# EAGLE design EEZ AUX PS r4B39 (EAGLE 6.1)
Assembly variants: Farnell, TME
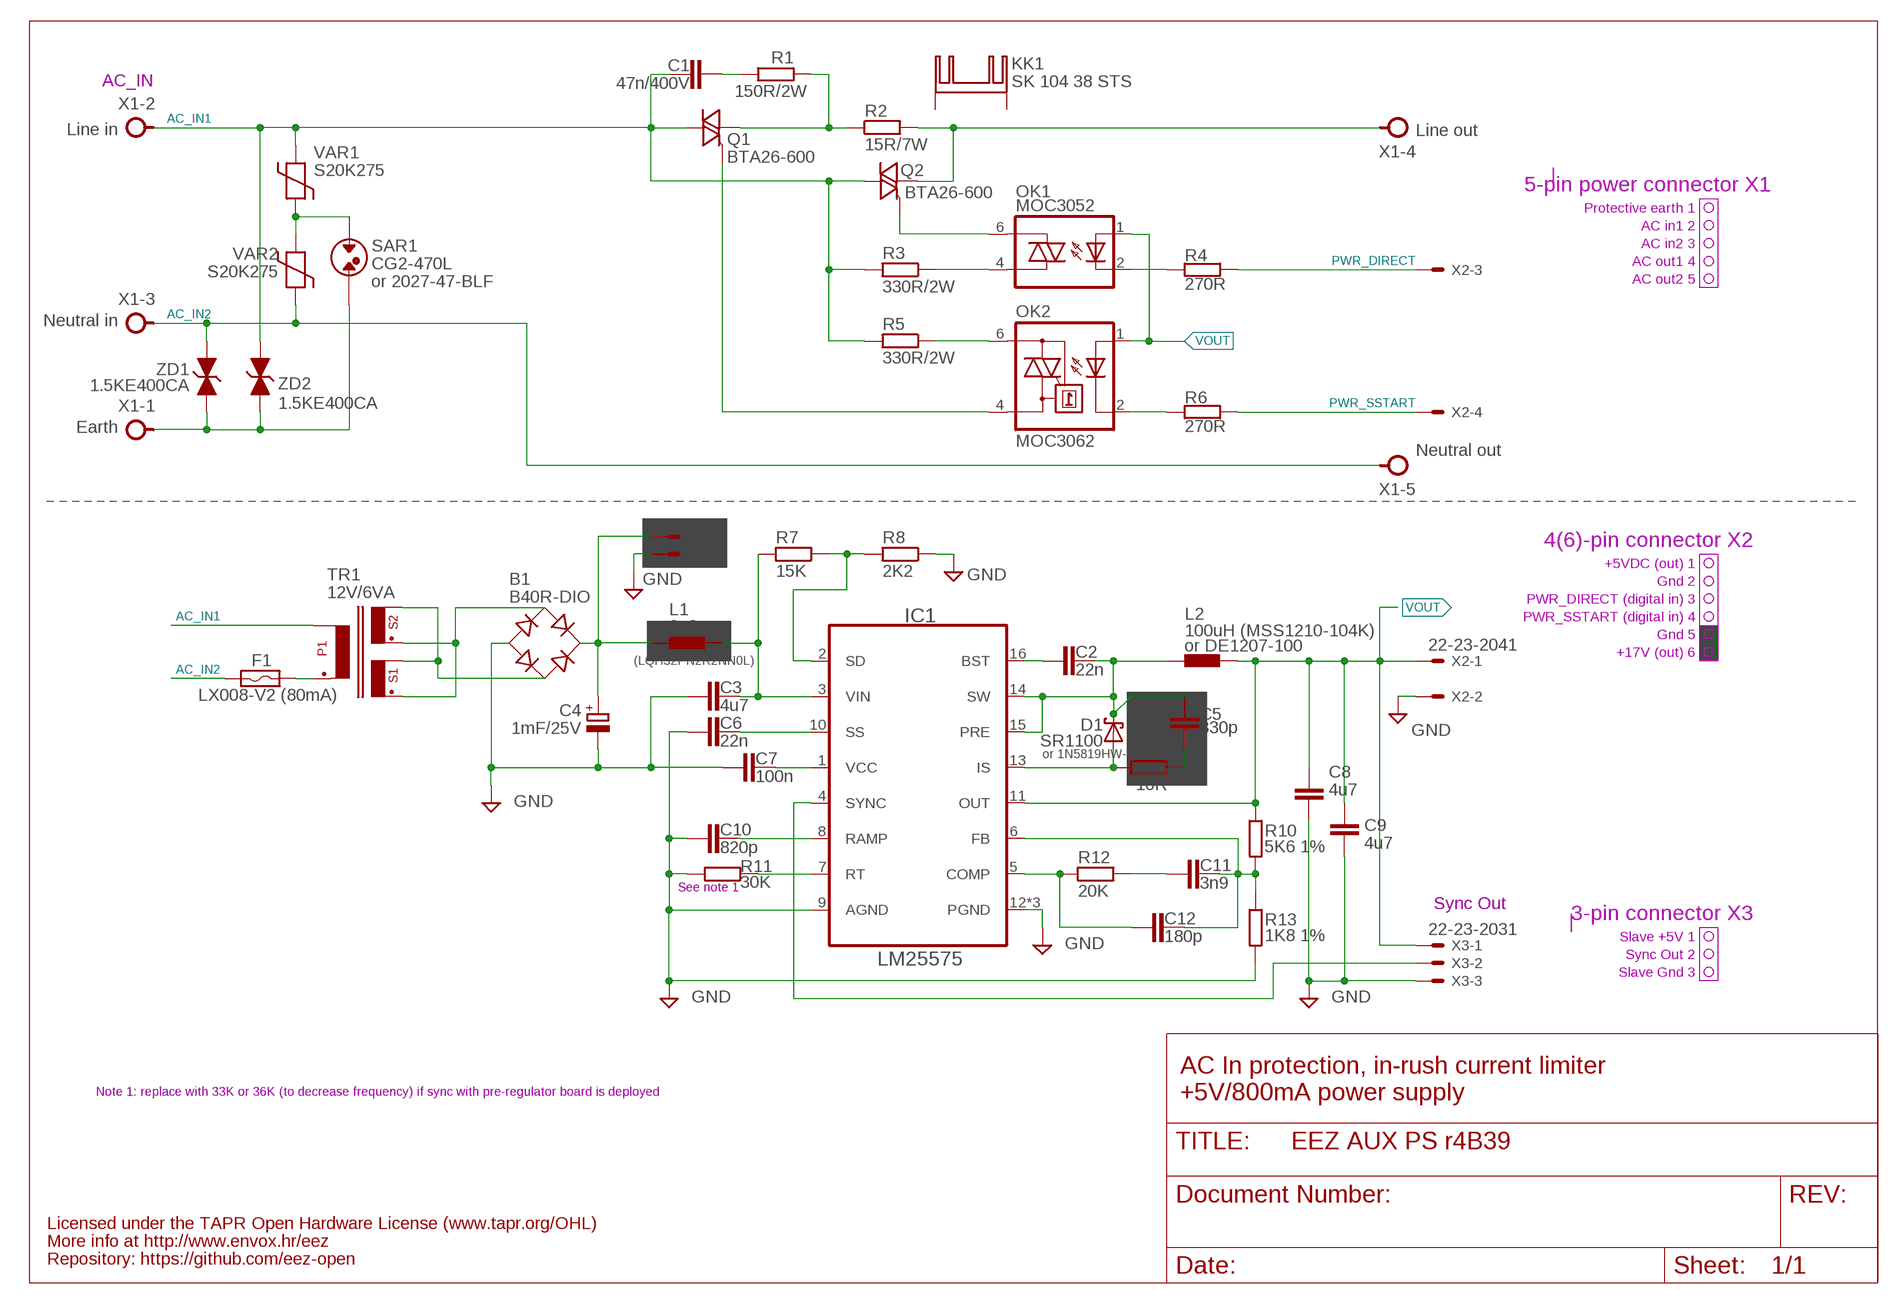
[diagram p0: schematic, sheet 1]

## Parts
B1  B40R-DIO  RECTIFIER-RB1A  [RB1A]
C1  47n/400V  C-EU075-052X106  [C075-052X106]
C2  22n  C-EUC0805  [C0805]
C3  4u7  C-EUC1210  [C1210]
C4  1mF/25V  ECAP5G_10.5MM  [ECAP5/10.5]
C5  330p  C-EUC0805  [C0805]
C6  22n  C-EUC0805  [C0805]
C7  100n  C-EUC0805  [C0805]
C8  4u7  C-EUC1210  [C1210]
C9  4u7  C-EUC1210  [C1210]
C10  820p  C-EUC0805  [C0805]
C11  3n9  C-EUC0805  [C0805]
C12  180p  C-EUC0805  [C0805]
D1  SR1100  SCHOTTKYDO34+SOD123  [DO34+SOD123]
F1  LX008-V2 (80mA)  FUSE_RESETTABLER7  [POLYSWITCH-R7]
IC1  LM25575  LM(2)5575  [SOP65P640X110-17N_HOLE]
KK1  SK 104 38 STS  SK409  [SK409]
L1  2u2  L1210  [L1210]
L2  100uH (MSS1210-104K)  COILCRAFT_MSS1278  [MSS1278]
OK1  MOC3052  MOC305X  [DIL6-SMD]
OK2  MOC3062  MOC3033S  [DIL6-SMD]
Q1  BTA26-600  BTA26-V  [TOP3S-1]
Q2  BTA26-600  BTA26-V  [TOP3S-1]
R1  150R/2W  R-EU_R2512  [R2512]
R2  15R/7W  R_EU7W  [R_0913]
R3  330R/2W  R-EU_R2512  [R2512]
R4  270R  R-EU_R0805  [R0805]
R5  330R/2W  R-EU_R2512  [R2512]
R6  270R  R-EU_R0805  [R0805]
R7  15K  R-EU_R0805  [R0805]
R8  2K2  R-EU_R0805  [R0805]
R9  10R  R-EU_R1206  [R1206]
R10  5K6 1%  R-EU_R0805  [R0805]
R11  30K  R-EU_R0805  [R0805]
R12  20K  R-EU_R0805  [R0805]
R13  1K8 1%  R-EU_R0805  [R0805]
SAR1  CG2-470L  SAR  [SAR]
TR1  12V/6VA  PCB_TRAFO6VACOMBO  [PCB_TRAFO6VA_DUAL]
VAR1  S20K275  VARISTOR  [VARISTOR]
VAR2  S20K275  VARISTOR  [VARISTOR]
X1  AC_IN  TBLOCK5.0_5A  [TBLOCK5.0_5]
X2  22-23-2041  22-23-2061  [22-23-2061]
X3  22-23-2031  [22-23-2031]
ZD1  1.5KE400CA  1.5KE-BIDIR  [DO201-BIDIR]
ZD2  1.5KE400CA  1.5KE-BIDIR  [DO201-BIDIR]

## Nets
AC_EARTH: SAR1.P$2 X1.1 ZD1.C ZD2.C
AC_IN1: C1.2 Q1.A2 Q2.A2 R3.2 R5.2 TR1.NC1(P1) TR1.P1 TR1.P1.1(P1) TR1.P1.2(P1) VAR1.P$2 X1.2 ZD2.A
AC_IN2: F1.P$1 VAR2.P$1 X1.3 X1.5 ZD1.A
DC_PREG1: C3.1 IC1.3(VIN) L1.2 R7.2
GND [gnd]: B1.- C3.2 C4.- C6.2 C7.1 C8.2 C9.2 C10.1 IC1.9(AGND) IC1.12(PGND) IC1.TP2(PGND) IC1.TP(PGND) R8.1 R11.2 R13.2 X2.2 X2.5 X3.3
IS: D1.A D1.A.1(A) IC1.13(IS) R9.1
N$1: C5.2 R9.2
N$2: OK1.6(A2) Q2.G
N$3: OK1.4(A1) R3.1
N$4: OK2.4(A1) Q1.G
N$5: OK1.2(C) R4.1
N$6: OK2.2(C) R6.1
N$7: OK2.6(A2) R5.1
N$8: Q2.A1 R2.2 X1.4
N$13: IC1.4(SYNC) X3.2
N$15: C1.1 R1.1
N$16: Q1.A1 R1.2 R2.1
N$40: B1.AC2 TR1.S1.2 TR1.S1.2A(S1.2) TR1.S1.2NC(S1.2) TR1.S2.2
N$77: C11.2 R12.2
N$114: SAR1.P$1 VAR1.P$1 VAR2.P$2
N$128: C11.1 C12.1 IC1.6(FB) R10.2 R13.1
N$131: C2.2 IC1.16(BST)
N$135: C12.2 IC1.5(COMP) R12.1
N$141: B1.AC1 TR1.S1.1 TR1.S2.1 TR1.S2.1A(S2.1)
N$162: F1.P$2 TR1.P2 TR1.P2.1(P2) TR1.P2.2(P2)
N$165: IC1.7(RT) R11.1
N$166: C7.2 IC1.1(VCC)
N$167: C10.2 IC1.8(RAMP)
N$168: C6.1 IC1.10(SS)
N$180: IC1.2(SD) R7.1 R8.2
PWR_DIRECT: R4.2 X2.3
PWR_SSTART: R6.2 X2.4
SW: C2.1 C5.1 D1.C D1.C.1(C) IC1.14(SW) IC1.15(PRE) L2.1
VIN: B1.+ C4.+ L1.1 X2.6
VOUT: C8.1 C9.1 IC1.11(OUT) L2.2 OK1.1(A) OK2.1(A) R10.1 X2.1 X3.1
Unconnected: KK1.K1(K) KK1.K2(K)

## Notes on the sheet
- Line in
- Line out
- 5-pin power connector X1
- Protective earth 1
- AC in1 2
- AC in2 3
- AC out1 4
- AC out2 5
- or 2027-47-BLF
- Neutral in
- Earth
- Neutral out
- 4(6)-pin connector X2
- +5VDC (out) 1
- Gnd 2
- PWR_DIRECT (digital in) 3
- PWR_SSTART (digital in) 4
- Gnd 5
- +17V (out) 6
- or DE1207-100
- (LQH32PN2R2NN0L)
- or 1N5819HW-7-F
- See note 1
- Sync Out | 3-pin connector X3
- Slave +5V 1
- Sync Out 2
- Slave Gnd 3
- AC In protection, in-rush current limiter
- Note 1: replace with 33K or 36K (to decrease frequency) if sync with pre-regulator board is deployed
- +5V/800mA power supply
- Licensed under the TAPR Open Hardware License (www.tapr.org/OHL)
- More info at http://www.envox.hr/eez
- Repository: https://github.com/eez-open

## Library data of the parts
B1 = rectifier:RECTIFIER-: Rectifier
C1-C3 C5-C12 = rcl:C-EU: CAPACITOR, European symbol
C4 = EEZ_Lib1:ECAP
D1 = EEZ_Lib1:SCHOTTKY
F1 = EEZ_Lib1:FUSE_RESETTABLE
IC1 = EEZ_Lib1:LM(2)5575: Simple Switcher® 42V, 1.5A Step-Down Switching Regulator
KK1 = EEZ_Lib1:SK409
L1 = EEZ_Lib1:L1210
L2 = EEZ_Lib1:COILCRAFT_MSS1278: Coilcraft SMT Power Inductors – MSS1278
OK1 = EEZ_Lib1:MOC305X: 6-pin DIP Random-phase Optoisolators Triac Drivers (600V Peak)
OK2 = optocoupler:MOC30*: 6-Pin DIP Zero-Cross Optoisolators Triac Driver Output (250/400 Volt Peak) Source: http://www.fairchildsemi.com/ds/MO/MOC3043-M.pdf; MF: FAIRCHILD SEMICONDUCTOR; MPN: MOC3033S-M; OC_FARNELL: unknown; OC_NEWARK: 05C2878
Q1 Q2 = triac:BTA26: 25A TRIAC Source: http://www.st.com/stonline/products/literature/ds/7470.pdf
R1 R3-R13 = rcl:R-EU_: RESISTOR, European symbol
R2 = EEZ_Lib1:R_EU: RESISTOR - European symbol
SAR1 = EEZ_Lib1:SAR: EPCOS surge arrester EF470X Farnell: 1886596
TR1 = EEZ_Lib1:PCB_TRAFO6VA: TEZ 6VA transformer for PCB
VAR1 VAR2 = MyLib:VARISTOR: EPCOS - B72220S0251K101 - VARISTOR, 140J, 250VAC Farnell: 1004357
X1 = EEZ_Lib1:TBLOCK5.0_5A
X2 = con-molex:22-23-2061: .100" (2.54mm) Center Header - 6 Pin; MF: MOLEX; MPN: 22-23-2061; OC_FARNELL: 1462922; OC_NEWARK: 27C1933
X3 = con-molex:22-23-2031: .100" (2.54mm) Center Header - 3 Pin; MF: MOLEX; MPN: 22-23-2031; OC_FARNELL: 1462950; OC_NEWARK: 30C0862
ZD1 ZD2 = EEZ_Lib1:1.5KE-BIDIR

## Net classes
0 default: width 0.254 mm, drill 0.61 mm
2 gnd: width 0.254 mm, drill 0.61 mm, clearance 0.254 mm

## Board
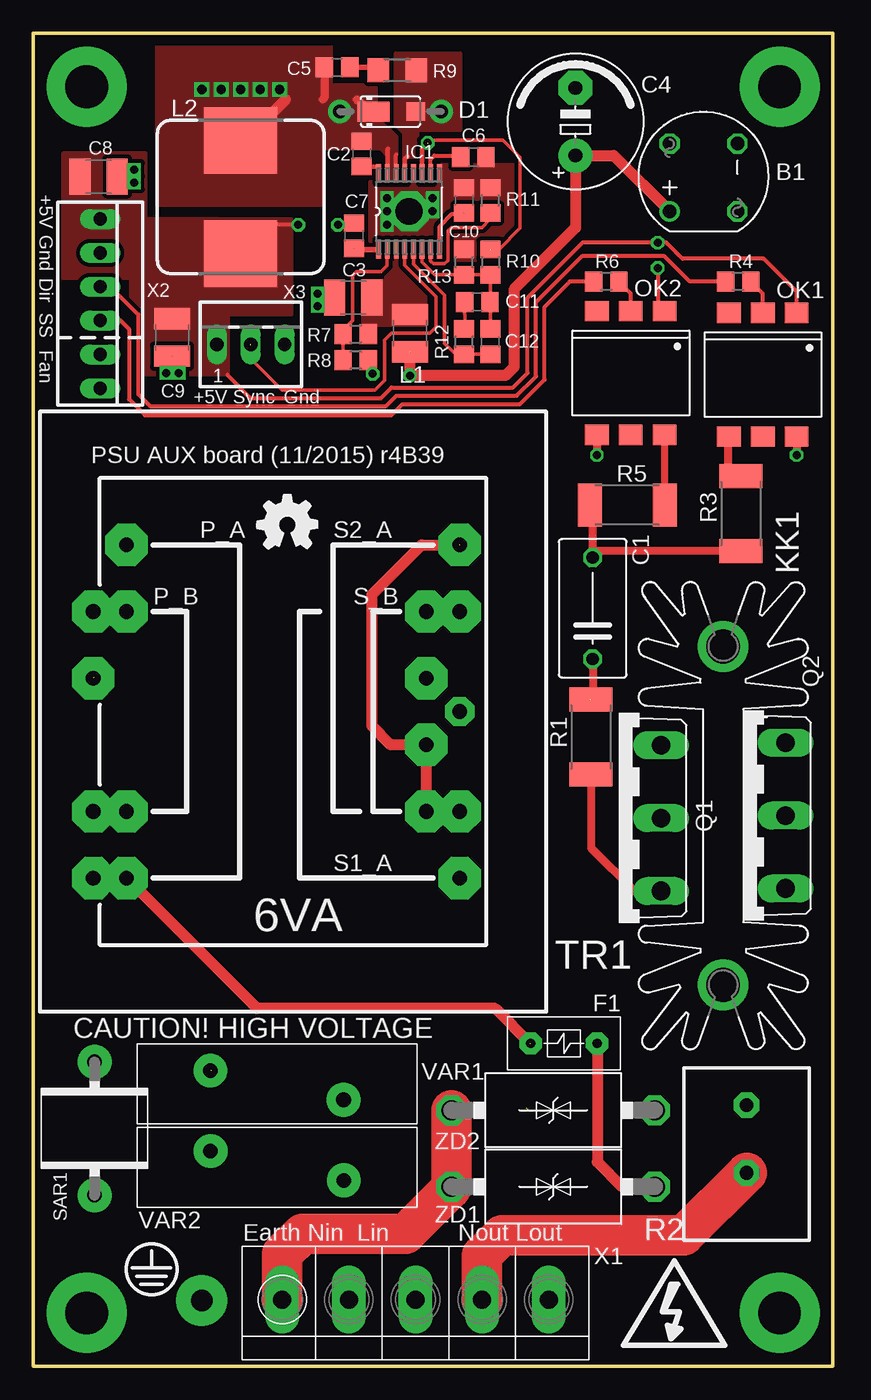
[diagram p1: board, top side]
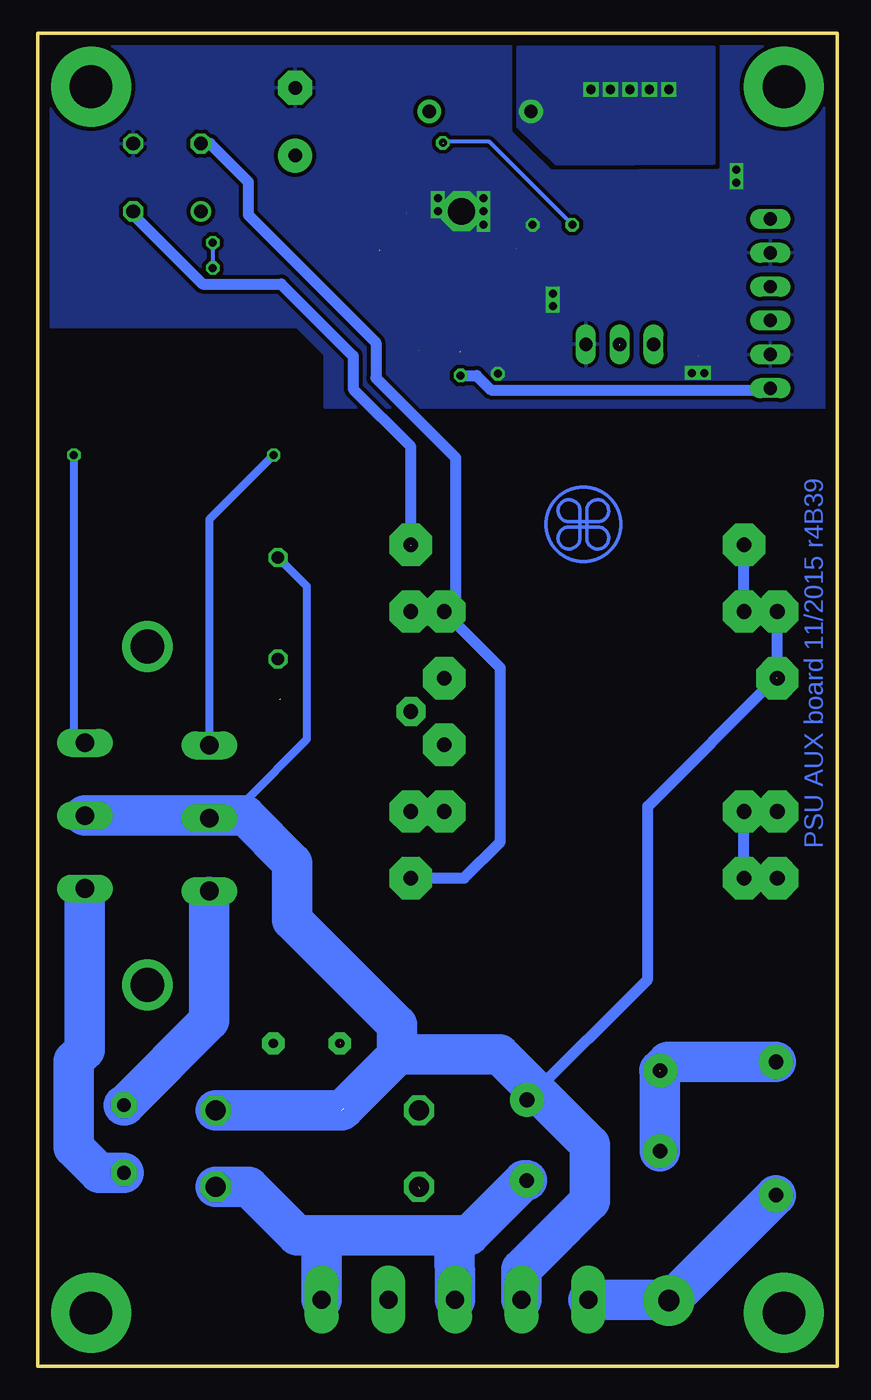
[diagram p2: board, bottom side, seen from below]

Size 60 x 100 mm. Coordinates in mm from the lower left corner, seen from the top.
Outline: 0,0 0,100 60,100 60,0 0,0
Copper layers (1+5*16): Top 0.035mm / dielectric 0.75mm / Route5 0.035mm / dielectric 0.75mm / Bottom 0.035mm
Design rules: minimum track width 10mil, minimum drill 0.5mm, track to track 8mil, track to pad 8mil, pad to pad 8mil, via to via 8mil, smd to smd 8mil, copper to edge 30mil, drill to drill 8mil, minimum pad ring 10mil, minimum via ring 8mil, stop-mask expansion 0mil, vias tented up to drill 25mil, thermal gap 10mil

### Footprints (pad centres in the part's own frame; a part is rotated, then mirrored left to right if it is on the bottom)
RB1A = drill 1.016: + -2.54,2.54 | drill 1.016 octagon: - 2.54,-2.54; AC1 2.54,2.54; AC2 -2.54,-2.54
C075-052X106 = drill 0.914 octagon: 1 -3.81,0; 2 3.81,0
C0805 = smd 1.3 x 1.5: 1 -0.95,0; 2 0.95,0
C1210 = smd 1.6 x 2.7: 1 -1.4,0; 2 1.4,0
ECAP5/10.5 = drill 1.016 pad 2.54: + -2.54,0 | drill 1.016 pad 2.54 octagon: - 2.54,0
DO34+SOD123 = drill 1 pad 1.778: A 3.81,0; C -3.81,0 | smd 1.4 x 1.4: A.1 1.9,0 | smd 2.4 x 1.5: C.1 -1.27,0
POLYSWITCH-R7 = drill 0.7 pad 1.676 octagon: P$1 -2.5,0; P$2 2.5,0
SOP65P640X110-17N_HOLE = smd 1.422 x 0.356: 1 -2.845,2.286; 2 -2.845,1.626; 3 -2.845,0.965; 4 -2.845,0.33; 5 -2.845,-0.33; 6 -2.845,-0.965; 7 -2.845,-1.626; 8 -2.845,-2.286; 9 2.845,-2.286; 10 2.845,-1.626; 11 2.845,-0.965; 12 2.845,-0.33; 13 2.845,0.33; 14 2.845,0.965; 15 2.845,1.626; 16 2.845,2.286 | smd 2.032 x 2.032: TP 0,0 | drill 2 octagon: TP2 0,0
SK409 = drill 2.54 pad 3.81: K1 -12.7,-1.512; K2 12.7,-1.512
L1210 = smd 1.6 x 2.7: 1 -1.4,0; 2 1.4,0
MSS1278 = smd 5.5 x 5: 1 0,4.25; 2 0,-4.25
DIL6-SMD = smd 1.78 x 1.52: 1 -2.54,-4.645; 2 0,-4.645; 3 2.54,-4.645; 4 2.54,4.645; 5 0,4.645; 6 -2.54,4.645
TOP3S-1 = drill 1.397 long: A1 -5.461,-3.175; A2 0,-3.175; G 5.461,-3.175
R2512 = smd 1.8 x 3.2: 1 -2.8,0; 2 2.8,0
R_0913 = drill 1.016 pad 1.93 octagon: 1 -3.556,0; 2 1.524,0
R0805 = smd 1.3 x 1.5: 1 -0.95,0; 2 0.95,0
R1206 = smd 1.6 x 1.803: 1 -1.422,0; 2 1.422,0
SAR = drill 1.1 pad 2.54: P$1 0,0; P$2 10,0
PCB_TRAFO6VA_DUAL = drill 1.1 pad 3.175 octagon: NC1 -15,2.5; NC2 -15,-12.5; NC4 10,2.5; P1 -12.5,12.5; P1.1 -12.5,7.5; P1.2 -15,7.5; P2 -12.5,-12.5; P2.1 -12.5,-7.5; P2.2 -15,-7.5; S1.1 12.5,-12.5; S1.2 12.5,-7.5; S1.2A 10,-2.5; S1.2NC 10,-7.5; S2.1 12.5,7.5; S2.1A 10,7.5; S2.2 12.5,12.5 | drill 1.1 pad 2.184 octagon: NC3 12.5,0
VARISTOR = drill 1.1 pad 2.54: P$1 0,0; P$2 10,-2.2
TBLOCK5.0_5 = drill 1.35 pad 2.54 long: 1 0,0; 2 0,-5; 3 0,-10; 4 0,-15; 5 0,-20
22-23-2061 = drill 1 long: 1 -6.35,0; 2 -3.81,0; 3 -1.27,0; 4 1.27,0; 5 3.81,0; 6 6.35,0
22-23-2031 = drill 1 long: 1 -2.54,0; 2 0,0; 3 2.54,0
DO201-BIDIR = drill 1.499 octagon: A 7.62,0; C -7.62,0

### Placement (x,y rotation side)
B1  50.29,89.18 90 top
C1  41.98,56.86 90 top
C2  24.64,90.96 270 top
C3  24.01,80.17 180 top
C4  40.68,93.37 90 top
C5  22.8,97.44 0 top
C6  33.02,90.71 0 top
C7  24.07,84.8 270 top
C8  4.89,89.25 0 top
C9  10.42,77.18 270 top
C10  32.32,87.47 270 top
C11  33.31,79.85 180 top
C12  34.29,76.86 270 top
D1  26.8,94.14 0 top
EEZ_SIGNATURE  SIGNATURESMALL  [SIGNATURE_5MM]  19.05,63.16 180 top
F1  39.82,24.22 180 top
IC1  28.2,86.64 90 top
KK1  53.28,41.3 270 top
L1  28.26,77.5 90 top
L2  15.56,87.72 0 top
OK1  54.74,74.39 180 top
OK2  44.83,74.52 180 top
Q1  43.94,41.11 90 top
Q2  53.28,41.3 90 top
R1  41.85,47.21 270 top
R2  53.53,16.03 270 top
R3  53.09,63.97 270 top
R4  52.9,81.37 180 top
R5  44.58,64.61 180 top
R6  42.99,81.37 180 top
R7  24.2,77.44 0 top
R8  24.2,75.47 180 top
R9  27.31,97.25 180 top
R10  34.29,82.83 270 top
R11  34.29,87.47 90 top
R12  32.32,76.86 90 top
R13  32.32,82.83 90 top
SAR1  4.6,22.83 270 top
TR1  19.5,49.12 0 top
VAR1  13.28,22.18 0 top
VAR2  23.3,13.93 180 top
X1  18.68,5 90 top
X2  5.02,79.72 270 top
X3  16.32,76.67 0 top
ZD1  39.02,13.46 0 top
ZD2  39.02,19.19 0 top

### Tracks (layer width: path | path; a pad name or v marks a point on that pad's centre or on a via)
AC_EARTH  (via drill 1.6 pad 3.81)  (1 unrouted)
  Top 3.048: ZD1.C ZD2.C | X1.1 18.68,8.42 20.2,9.94 27.94,9.94 31.31,13.3
  Bottom 3.048: X1.1 12.75,5 v12.64,4.92 12.51,4.92 SAR1.P$2
AC_IN1  (2 unrouted)
  Top 0.61: C1.2 41.98,61.18 | 41.98,61.18 41.98,64.41 R5.2 | R3.2 41.98,61.17 41.98,61.18
  Bottom 0.61: C1.2 39.82,58.51 39.82,47.02 44.45,42.38 44.45,41.3 | Q1.A2 44.83,41.11 44.64,41.3
  Bottom 0.813: TR1.NC1 TR1.P1.2 TR1.P1.1 TR1.P1 | 4.58,51.66 14.23,42 14.23,29.04 VAR1.P$2 22.51,20.76 25.15,23.4 25.34,23.4
  Bottom 3.048: X1.2 23.68,7.27 18.55,12.41 18.55,16.6 25.34,23.4 32.96,23.4 33.02,23.33 | Q2.A2 44.64,41.3 44.45,41.3 40.9,37.75 40.9,33.49 33.02,25.62 33.02,23.33 | 37.21,19.21 46.62,19.21 ZD2.A | 33.02,23.33 37.02,19.33
AC_IN2
  Top 0.813: 45.41,13.46 ZD1.A 44.17,13.46 42.32,15.32 F1.P$1
  Bottom 3.048: ZD1.A 44.17,13.46 40.52,9.81 38.67,9.81 | X1.5 38.68,9.8 38.67,9.81 | 28.7,9.81 27.62,9.81 23.5,13.93 VAR2.P$1 | 28.7,9.81 38.67,9.81 | X1.3 28.7,9.81
DC_PREG1
  pour Top (isolate 0.305, no thermals): 27.18,83.79 27.31,83.79 27.31,82.58 27.82,82.07 29.02,80.93 29.47,80.55 29.47,78.07 24.7,78.07 24.7,81.5 26.42,81.5 26.42,82.83 27.18,82.83
GND  (via drill 0.6)  (1 unrouted)
  Top 0.254: v21.34,80.48 22.29,80.48 C3.2 | v25.47,74.45 R8.1
  Top 0.305: C7.1 v22.86,85.63 | v9.97,74.52 9.91,75.28 C9.2 | v7.56,88.8 6.8,88.74 C8.2
  other vias: 10.92,74.52 7.56,89.75 26.55,87.65 26.55,86.64 26.55,85.64 21.34,79.53 29.97,87.65 29.97,86.64
  pour Bottom (isolate 0.305, rank 2): 0.32,99.6 59.69,99.6 59.69,78.01 40.52,78.01 38.42,75.91 38.42,71.97 0.32,71.97
  pour Top (isolate 0.305, no thermals): 25.28,88.87 30.61,88.87 30.61,90.14 36.07,90.14 36.07,82.96 31.5,82.96 31.5,84.42 25.28,84.42
IS
  Top 0.356: IC1.13 27.87,90.57 28.07,90.77
  pour Top (isolate 0.305, no thermals): 27.82,89.75 27.82,92.49 27.18,93.12 27.18,98.52 32.07,98.52 32.07,92.74 28.83,92.74 28.83,90.71 28.07,90.71 27.94,90.58 27.94,89.75
N$1
  Top 0.406: C5.2 25.59,97.44 R9.2
N$2  (via drill 0.6)
  Top 0.61: OK1.6 v57.28,68.35
  Bottom 0.61: v57.28,68.35 57.28,47.59 Q2.G
N$3
  Top 0.508: 52.13,69.67 OK1.4
  Top 0.61: 52.13,69.67 52.13,66.71 52.14,66.7 53.02,66.7 R3.1
N$4  (via drill 0.6)
  Top 0.61: OK2.4 v42.29,68.35
  Bottom 0.61: v42.29,68.35 47.12,63.53 Q1.G
N$5
  Top 0.305: OK1.2 54.74,80.48 R4.1
N$6
  Top 0.305: OK2.2 44.83,80.48 R6.1
N$7
  Top 0.508: OK2.6 47.37,66.65 R5.1
N$8
  Top 3.048: X1.4 33.68,8.31 35.18,9.81 48.83,9.81 R2.2
  Bottom 0.61: Q2.A1 56.45,35.34
  Bottom 3.048: 56.45,35.34 56.45,23.71 57.28,22.89 57.28,16.41 55.37,14.51 R2.2
N$13  (1 unrouted)
  Top 0.254: 27.88,83.8 IC1.4 27.87,82.59 30.23,80.23 30.23,77.94 29.78,77.5 26.86,77.5 26.36,76.99 26.36,73.94 25.66,73.24 18.67,73.24 16.32,75.59 16.32,76.61
N$15  (1 unrouted)
  Top 0.61: C1.1 41.98,49.81 | 41.98,49.75 41.98,49.81 | 41.98,49.81 41.79,50
N$16
  Top 0.61: 40.71,44.23 40.89,44.41 R1.2 41.85,38.89 45.09,35.65 Q1.A1
  Bottom 0.61: Q1.A1 47.12,35.21
  Bottom 3.048: R2.1 53.47,19.59 47.12,25.94 47.12,35.21
N$40  (1 unrouted)
  Top 0.813: TR1.S1.2NC TR1.S1.2A 26.82,46.62 25.4,48.04 25.4,57.88 29.15,61.62 TR1.S2.2
  Bottom 0.813: TR1.S1.2 TR1.S1.2NC | 31.99,61.62 TR1.S2.2 32,68.98 36.32,73.31 36.32,75.78 41.72,81.18 47.63,81.18 52.84,86.39 B1.AC2
N$77
  Top 0.254: C11.2 32.39,78.01 R12.2
N$114  (1 unrouted)
  Bottom 3.048: SAR1.P$1 12.69,22.84 13.34,22.19 | VAR2.P$2 13.3,22.16 VAR1.P$1
N$128
  Top 0.254: IC1.6 29.16,82.82 30.1,81.88 R13.1 R10.2 34.29,80.04 C11.1 34.29,79.91 C12.1
N$131
  Top 0.356: C2.2 25.84,90.01 25.91,89.95 IC1.16
N$135  (1 unrouted)
  Top 0.254: IC1.5 28.53,82.69 30.86,80.36 30.86,76.74 31.37,76.23 | C12.2 R12.1 31.69,75.91 31.37,76.23
N$141
  Bottom 0.813: TR1.S2.1A TR1.S2.1 | B1.AC1 47.06,91.72 44.2,88.87 44.2,86.39 34.61,76.8 34.61,74.13 28.64,68.16 28.64,57.47 TR1.S2.1A | TR1.S1.1 28,36.62 25.28,39.34 25.28,52.39 TR1.S2.1A
N$162  (1 unrouted)
  Top 0.813: TR1.P2 16.79,26.83 34.67,26.83 37.28,24.22
  Bottom 0.813: TR1.P2 TR1.P2.1 TR1.P2.2
N$165
  Top 0.254: IC1.7 29.82,82.92 30.04,82.71 30.86,82.71 31.12,82.96 31.12,85.18 31.37,85.44 33.66,85.44 34.23,86.01 R11.1
N$166  (1 unrouted)
  Top 0.356: IC1.1 25.73,83.8 25.72,83.79
  Top 0.406: 25.72,83.79 24.13,83.79 C7.2
N$167  (1 unrouted)
  Top 0.305: IC1.8 30.48,85.5 31.44,86.45 32.26,86.45 C10.2
N$168
  Top 0.305: IC1.10 29.82,90.55 30.1,90.83 31.95,90.83 C6.1
N$180
  Top 0.254: IC1.2 26.55,83.8 | 26.55,83.8 26.55,83.85 | 26.55,83.8 26.55,82.58 26.1,82.13 24.26,82.13 23.94,81.82 23.94,78.45 23.25,77.76 R7.1 R8.2
PWR_DIRECT
  Top 0.305: R4.2 49.28,81.37 47.37,83.28 41.15,83.28 37.72,79.85 37.72,74.26 36.26,72.8 27.24,72.8 26.48,72.04 8.77,72.04 7.88,72.93 7.88,78.9 5.78,80.99 X2.3
PWR_SSTART
  Top 0.305: R6.2 40.26,81.37 38.36,79.47 38.36,74.01 36.52,72.17 27.69,72.17 26.86,71.34 8.38,71.34 7.18,72.55 7.18,77.82 6.54,78.45 X2.4
SW  (via drill 0.7)
  Top 0.305: IC1.14 27.23,90.91
  Top 0.356: IC1.15 26.57,91.3 26.61,91.34
  Top 0.61: C5.1 21.85,95.15 21.72,95.02 | D1.C.1 24.26,95.02
  Top 0.813: L2.1 15.87,91.97 18.93,95.02
  other vias: 18.48,95.79 17.02,95.79 15.56,95.79 14.1,95.79 12.64,95.79
  pour Top (isolate 0.305, no thermals): 9.27,87.09 9.27,99.09 10.73,99.09 19.69,99.15 22.35,99.15 22.35,96.1 25.72,96.1 25.72,93.76 27.24,92.23 27.24,90.9 27.18,90.83 27.18,88.93 26.55,88.93 26.55,90.83 26.04,91.34 21.91,91.34 21.59,91.02 21.59,87.09
  pour Bottom (no thermals): 9.27,98.96 9.27,90.26 21.08,90.2 23.94,92.99 23.94,98.96
TA1  (via drill 3.2 pad 6)
  other vias: 4,96
TA2  (via drill 3.2 pad 6)
  other vias: 56,96
TA3  (via drill 3.2 pad 6)
  other vias: 4,4
TA4  (via drill 3.2 pad 6)
  other vias: 56,4
VIN  (via drill 0.6)  (2 unrouted)
  Top 0.813: B1.+ 43.57,90.83 C4.+ 40.68,85.41 36.07,80.8 36.07,74.96 35.43,74.32 v28.26,74.32 L1.1
  Bottom 0.813: v28.26,74.32 27.05,74.32 25.97,73.24 5.15,73.24 X2.6
VOUT  (via drill 0.6)  (2 unrouted)
  Top 0.254: 29.59,91.72 29.85,91.98 35.24,91.98 36.52,90.71 36.52,85.37 34.93,83.79 34.42,83.79 34.36,83.72
  Top 0.305: 13.78,81.94 13.72,82.01 14.23,82.01 15.62,83.4 | 15.62,83.4 15.69,83.47 | L2.2 15.62,83.4 | v19.88,85.63 17.91,85.63 15.75,83.47 | v46.86,82.39 46.86,79.67 OK2.1 | OK1.1 57.28,80.61 54.8,83.09 48.71,83.09 47.5,84.29 v46.86,84.29 41.21,84.29 37.09,80.17 37.09,74.52 36.01,73.43 26.86,73.43 26.04,72.61 16.32,72.61 14.54,74.39
  Top 0.356: IC1.11 29.16,91.35 v29.59,91.79
  Bottom 0.305: v19.88,85.63 26.1,91.85 29.53,91.85 v29.59,91.79 | v46.86,84.29 v46.86,82.39
  pour Top (isolate 0.305, no thermals): 2.22,81.63 2.22,91.02 8.45,91.02 8.45,86.14 19.37,86.07 19.37,78.9 14.61,78.9 14.61,74.39 7.31,74.39 7.31,81.63

### Text on the board
Bottom: PSU AUX board 11/2015 r4B39
tPlace: +5V | Gnd | Dir | SS | Fan | +5V | Sync | Gnd | PSU AUX board (11/2015) r4B39 | CAUTION! HIGH VOLTAGE | Earth Nin Lin | Nout Lout
tDocu: Licensed under the TAPR Open Hardware License (www.tapr.org/OHL)
_tNames: C5 | R9 | C4 | L2 | D1 | C2 | C6 | C8 | IC1 | B1 | C7 | R11 | C10 | C3 | R13 | R10 | R6 | R4 | X2 | X3 | OK2 | OK1 | C11 | R7 | R8 | R12 | C12 | C9 | L1 | R5 | R3 | C1 | KK1 | Q2 | R1 | Q1 | TR1 | F1 | VAR1 | ZD2 | ZD1 | SAR1 | R2 | VAR2 | X1